# Altium project Mot-Gen-Set.PrjPcb
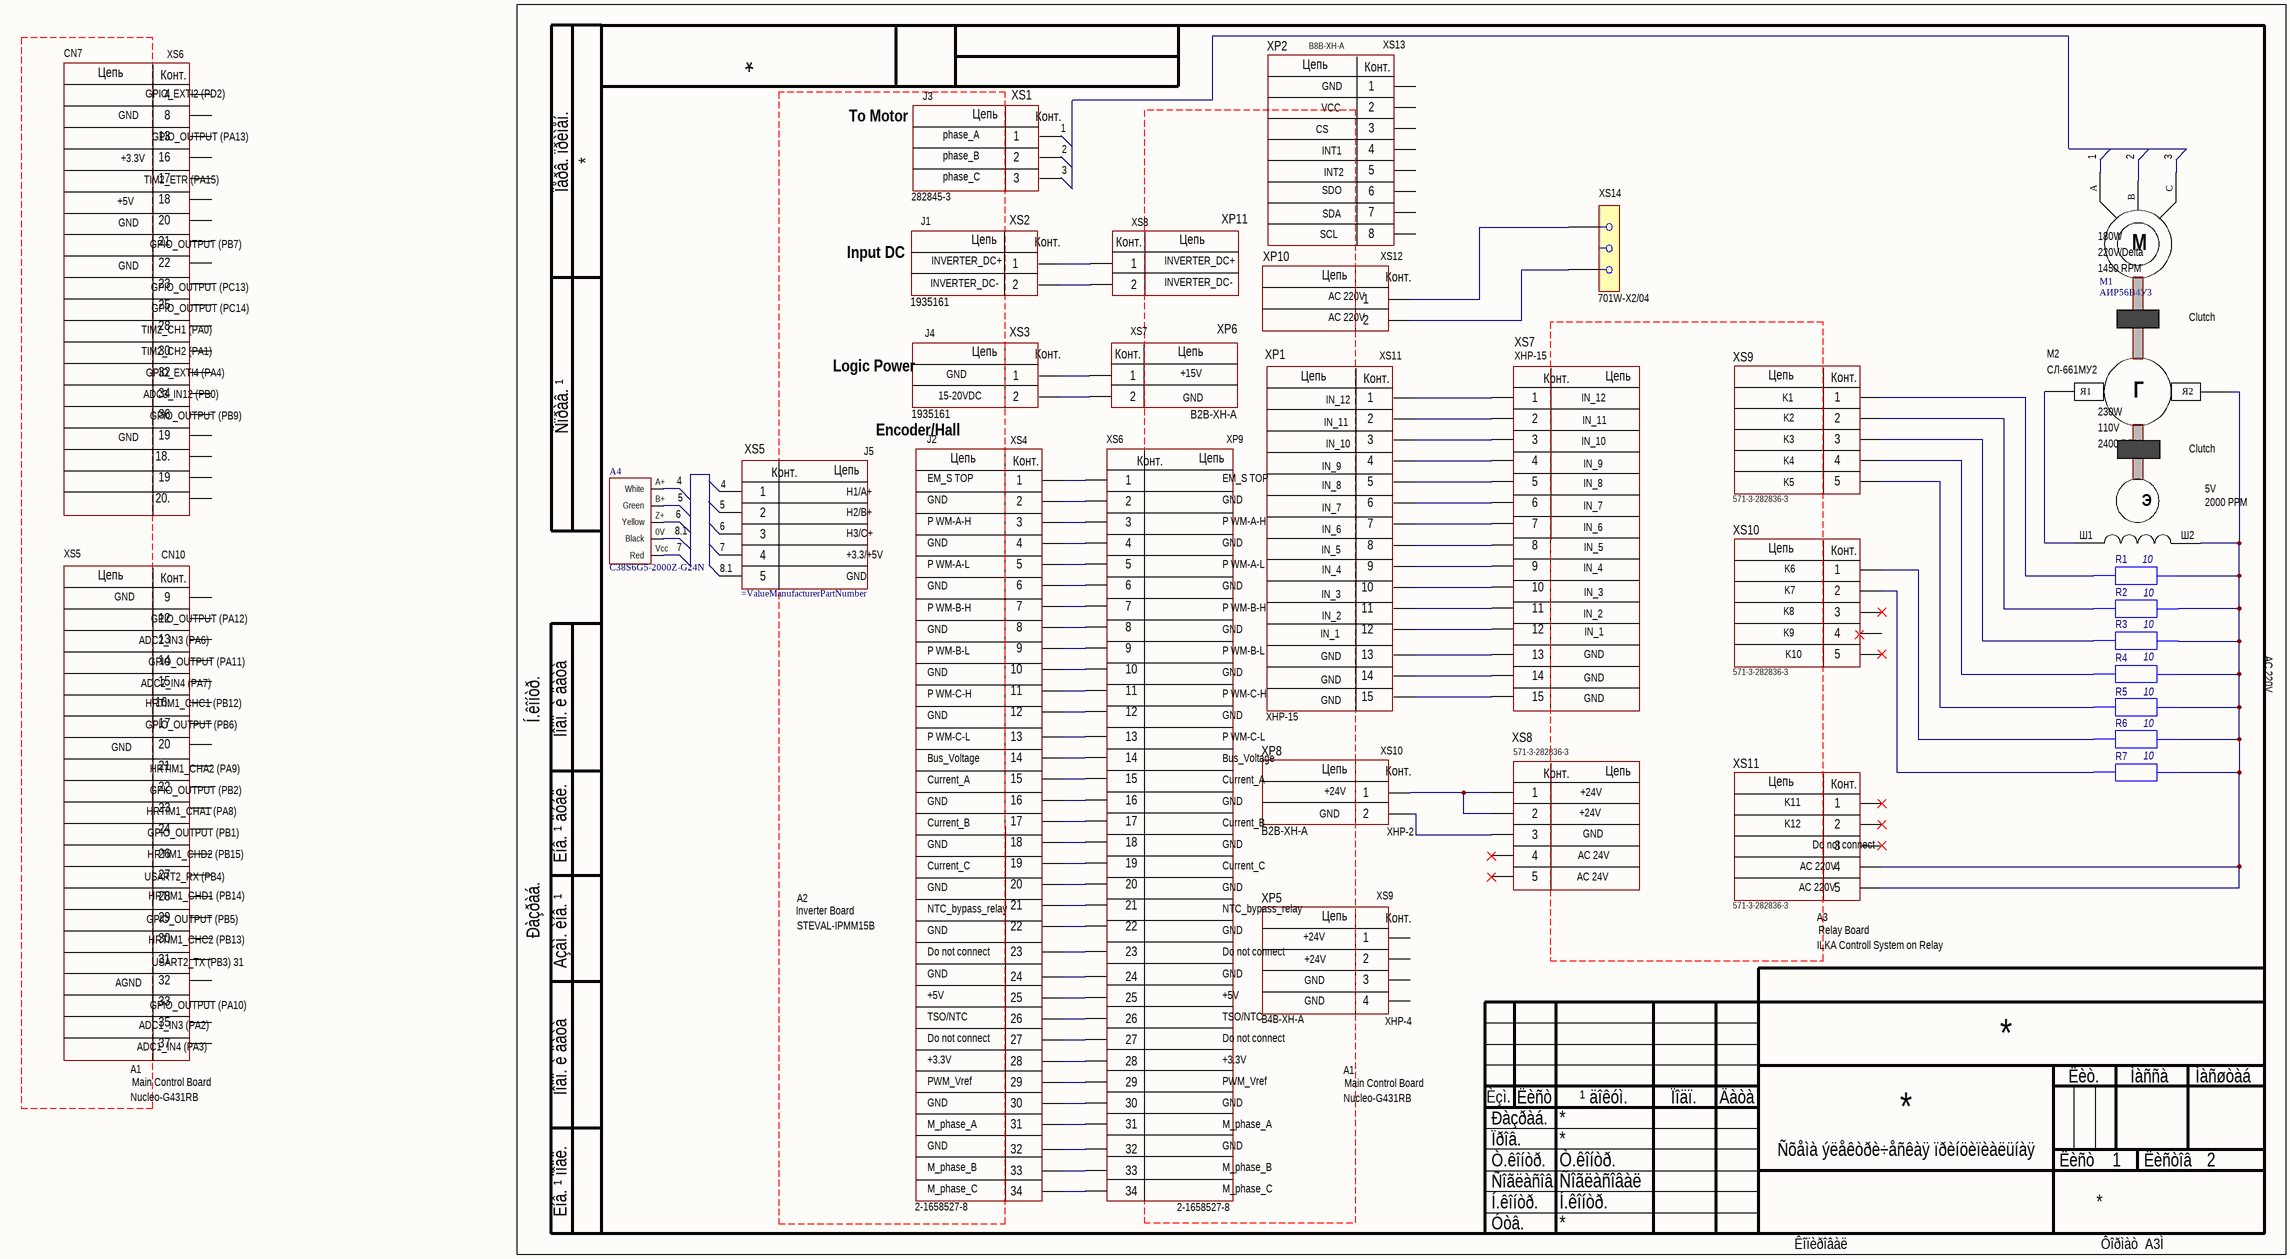
[diagram p0: wiring-harness-assembly.SchDoc]
2 sheets, 50 parts. Net scope: global (net labels, ports and power ports of the same name join across sheets).
Sheets:
  wiring-harness-assembly.SchDoc
  Nucleo-G431-Expansion-board.SchDoc

## Sheet wiring-harness-assembly.SchDoc
size 420 x 297 mm; SheetNumber: 1; SheetTotal: 2; PageSetup: Record=PageOptions¦CenterHorizontal=False¦CenterVertical=False¦PrintScale=0.95¦XCorrection=0.00¦YCorrection=0.00¦PrintKind=1¦BorderSize=5000000¦LeftOffset=0¦BottomOffset=0¦Orientation=1¦PaperLength=1000¦PaperWidth=1000¦Scale=100¦PaperSource=15¦PrintQuality=600¦MediaType=1¦DitherType=10¦PaperKind=A4¦PrintScaleMode=1; ProcessInspection: Ò.êîíòð.; NormInspection: Í.êîíòð.; Letter1Column: {}; Letter2Column: {}; Letter3Column: {}; DocumentType: Ñõåìà ýëåêòðè÷åñêàÿ ïðèíöèïèàëüíàÿ; AgreedBy: Ñîãëàñîâàë

### Parts
(Parts that share a designator on the sheet are numbered #1, #2 ... from top to bottom, then left to right.)
A4  C38S6G5-2000Z-G24N
M1  АИР56В4У3
M2  СЛ-661МУ2
R1  value 10  [R0805]  (hidden comment: Резистор 3 Ом ± 1% 100мВт 50В SMD 0603 -55...155°C CR-03FL7----3R "Viking")
R2  value 10  [R0805]  (hidden comment: Резистор 3 Ом ± 1% 100мВт 50В SMD 0603 -55...155°C CR-03FL7----3R "Viking")
R3  value 10  [R0805]  (hidden comment: Резистор 3 Ом ± 1% 100мВт 50В SMD 0603 -55...155°C CR-03FL7----3R "Viking")
R4  value 10  [R0805]  (hidden comment: Резистор 3 Ом ± 1% 100мВт 50В SMD 0603 -55...155°C CR-03FL7----3R "Viking")
R5  value 10  [R0805]  (hidden comment: Резистор 3 Ом ± 1% 100мВт 50В SMD 0603 -55...155°C CR-03FL7----3R "Viking")
R6  value 10  [R0805]  (hidden comment: Резистор 3 Ом ± 1% 100мВт 50В SMD 0603 -55...155°C CR-03FL7----3R "Viking")
R7  value 10  [R0805]  (hidden comment: Резистор 3 Ом ± 1% 100мВт 50В SMD 0603 -55...155°C CR-03FL7----3R "Viking")
XP1#1  XHP-15
XP2#1  B8B-XH-A
XP5#1  B4B-XH-A
XP6#1  B2B-XH-A
XP8#1  B2B-XH-A
XP10#1  B2B-XH-A  (value not drawn)
XP11#1  B2B-XH-A  (value not drawn)
XS1  282845-3
XS2  1935161
XS3  1935161
XS4  2-1658527-8
XS5#1  (no value)
XS5#2  CN10
XS6#1  CN7
XS6#2  2-1658527-8
XS7  XHP-15
XS8  571-3-282836-3
XS9  571-3-282836-3
XS10  571-3-282836-3
XS11  571-3-282836-3
XS14  701W-X2/04  [FP-701W-X2-04-MFG]

### Nets
1: M1.A XS1.1
2: M1.B(A) XS1.2
3: M1.C XS1.3
4: A4.A+(White)
5: A4.B+(Green)
6: A4.Z+(Yellow) XS5#1.3
7: A4.Vcc(Red) XS5#1.4
8.1: A4.0V(Black) XS5#1.5
NetM2_1: M2.1(Я1) M2.Ш1
NetM2_2: M2.2(Я2) M2.Ш2 R4.2 R5.2 R6.2 R7.2 XS11.4 XS11.5
NetR1_1: R1.1 XS9.1
NetR2_1: R2.1 XS9.2
NetR3_1: R3.1 XS9.3
NetR4_1: R4.1 XS9.4
NetR5_1: R5.1 XS9.5
NetR6_1: R6.1 XS10.1
NetR7_1: R7.1 XS10.2
NetXP1#1_1: XP1#1.1 XS7.1
NetXP1#1_2: XP1#1.2 XS7.2
NetXP1#1_3: XP1#1.3 XS7.3
NetXP1#1_4: XP1#1.4 XS7.4
NetXP1#1_5: XP1#1.5 XS7.5
NetXP1#1_6: XP1#1.6 XS7.6
NetXP1#1_7: XP1#1.7 XS7.7
NetXP1#1_8: XP1#1.8 XS7.8
NetXP1#1_9: XP1#1.9 XS7.9
NetXP1#1_10: XP1#1.10 XS7.10
NetXP1#1_11: XP1#1.11 XS7.11
NetXP1#1_12: XP1#1.12 XS7.12
NetXP1#1_13: XP1#1.13 XS7.13
NetXP1#1_14: XP1#1.14 XS7.14
NetXP1#1_15: XP1#1.15 XS7.15
NetXP6#1_1: XP6#1.1 XS3.1
NetXP6#1_2: XP6#1.2 XS3.2
NetXP8#1_1: XP8#1.1 XS8.1 XS8.2
NetXP8#1_2: XP8#1.2 XS8.3
NetXP10#1_1: XP10#1.1 XS14.1
NetXP10#1_2: XP10#1.2 XS14.2
NetXP11#1_1: XP11#1.1 XS2.1
NetXP11#1_2: XP11#1.2 XS2.2
NetXS4_1: XS4.1 XS6#2.1
NetXS4_2: XS4.2 XS6#2.2
NetXS4_3: XS4.3 XS6#2.3
NetXS4_4: XS4.4 XS6#2.4
NetXS4_5: XS4.5 XS6#2.5
NetXS4_6: XS4.6 XS6#2.6
NetXS4_7: XS4.7 XS6#2.7
NetXS4_8: XS4.8 XS6#2.8
NetXS4_9: XS4.9 XS6#2.9
NetXS4_10: XS4.10 XS6#2.10
NetXS4_11: XS4.11 XS6#2.11
NetXS4_12: XS4.12 XS6#2.12
NetXS4_13: XS4.13 XS6#2.13
NetXS4_14: XS4.14 XS6#2.14
NetXS4_15: XS4.15 XS6#2.15
NetXS4_16: XS4.16 XS6#2.16
NetXS4_17: XS4.17 XS6#2.17
NetXS4_18: XS4.18 XS6#2.18
NetXS4_19: XS4.19 XS6#2.19
NetXS4_20: XS4.20 XS6#2.20
NetXS4_21: XS4.21 XS6#2.21
NetXS4_22: XS4.22 XS6#2.22
NetXS4_23: XS4.23 XS6#2.23
NetXS4_24: XS4.24 XS6#2.24
NetXS4_25: XS4.25 XS6#2.25
NetXS4_26: XS4.26 XS6#2.26
NetXS4_27: XS4.27 XS6#2.27
NetXS4_28: XS4.28 XS6#2.28
NetXS4_29: XS4.29 XS6#2.29
NetXS4_30: XS4.30 XS6#2.30
NetXS4_31: XS4.31 XS6#2.31
NetXS4_32: XS4.32 XS6#2.32
NetXS4_33: XS4.33 XS6#2.33
NetXS4_34: XS4.34 XS6#2.34

Not connected (* = marked no-connect by the designer): R1 2; R2 2; R3 2; XP2#1 1 2 3 4 5 6 7 8; XP5#1 1 2 3 4; XS5#1 1 2; XS5#2 9 12 13 14 15 16(16.) 17 20 21 22(37) 23 24 26 27 28 29 30 31 32 33 35 37(22); XS6#1 4 8 13 16 17 18 18. 19 20 20. 21 22 23 25 28 30 32 34 36; XS8 4* 5*; XS10 3* 4 5*; XS11 1* 2* 3*

### Notes on the sheet
- GPIO_EXTI2 (PD2)
- J3
- GND
- (near XP2#1) XS13
- (near XS6#1) GPIO_OUTPUT (PA13)
- To Motor
- phase_A
- CS
- VCC
- +5V
- +3.3V
- TIM2_ETR (PA15)
- phase_B
- phase_C
- INT1
- SDO
- INT2
- (near XS6#1) GPIO_OUTPUT (PB7)
- Input DC
- J1
- (near XP11#1) XS8
- SCL
- SDA
- XS12
- (near M1) 180W
- (near M1) 220V/Delta
- (near XS6#1) GPIO_OUTPUT (PC13)
- (near XS6#1) GPIO_OUTPUT (PC14)
- AC 220V
- 1450 RPM
- TIM2_CH1 (PA0)
- TIM2_CH2 (PA1)
- J4
- XS7
- XS11
- Clutch
- ADC3_IN12 (PB0)
- GPIO_EXTI4 (PA4)
- (near XS6#1) GPIO_OUTPUT (PB9)
- Logic Power
- 15-20VDC
- +15V
- IN_12
- K1
- K2
- (near M2) 230W
- J5
- Encoder/Hall
- J2
- XP9
- IN_9
- IN_11
- IN_10
- K3
- K4
- (near M2) 110V
- (near M2) 2400 RPM
- (near M2) Clutch
- H1/A+
- H2/B+
- EM_S TOP
- P WM-A-H
- IN_8
- IN_7
- K5
- (near M2) Э
- (near M2) 2000 PPM
- (near M2) 5V
- H3/C+
- +3.3/+5V
- P WM-A-L
- IN_5
- IN_6
- IN_4
- K6
- (near XS5#2) GPIO_OUTPUT (PA12)
- P WM-B-H
- IN_3
- IN_2
- IN_1
- K8
- K7
- ADC2_IN3 (PA6)
- ADC2_IN4 (PA7)
- (near XS5#2) GPIO_OUTPUT (PA11)
- P WM-B-L
- K9
- K10
- HRTIM1_CHC1 (PB12)
- GPIO_OUTPUT (PB6)
- P WM-C-H
- P WM-C-L
- (near XS5#2) HRTIM1_CHA2 (PA9)
- (near XS5#2) GPIO_OUTPUT (PB2)
- Bus_Voltage
- Current_A
- +24V
- XS10
- HRTIM1_CHA1 (PA8)
- GPIO_OUTPUT (PB1)
- Current_B
- (near XP8#1) XHP-2
- K11
- K12
- Do not connect
- USART2_RX (PB4)
- HRTIM1_CHD2 (PB15)
- (near XS5#2) HRTIM1_CHD1 (PB14)
- A2
- Current_C
- (near XP5#1) XS9
- AC 24V
- GPIO_OUTPUT (PB5)
- (near XS5#2) HRTIM1_CHC2 (PB13)
- Inverter Board
- STEVAL-IPMM15B
- (near XS4) NTC_bypass_relay
- (near XS4) Do not connect
- (near XS6#2) NTC_bypass_relay
- (near XS6#2) Do not connect
- A3
- ILKA Controll System on Relay
- Relay Board
- AGND
- (near XS5#2) GPIO_OUTPUT (PA10)
- (near XS5#2) USART2_TX (PB3) 31
- ADC1_IN4 (PA3)
- ADC1_IN3 (PA2)
- TSO/NTC
- (near XP5#1) XHP-4
- A1
- Nucleo-G431RB
- Main Control Board
- PWM_Vref
- M_phase_A
- M_phase_C
- M_phase_B
- Labels drawn without touching a wire or pin: 4, 5, INVERTER_DC+, INVERTER_DC-
- Ïåðâ. ïðèìåí.
- Ñïðàâ. ¹
- Í.êîíòð.
- Ïîäï. è äàòà
- Èíâ. ¹ äóáë.
- Ðàçðàá.
- Âçàì. èíâ. ¹
- Èçì.
- Ëèñò
- ¹ äîêóì.
- Ïîäï.
- Äàòà
- Ëèò.
- Ìàññà
- Ìàñøòàá
- Ïðîâ.
- Ò.êîíòð.
- Ëèñòîâ
- Èíâ. ¹ ïîäë.
- Óòâ.
- Ñîãëàñîâ.
- Êîïèðîâàë
- Ôîðìàò  A3Ì
- (in symbol 2) Конт.; Цепь
- (in symbol 3) Цепь; Конт.
- (in symbol 4) Цепь; Конт.
- (in symbol 5) Цепь; Конт.
- (in symbol 8) Цепь; Конт.
- (in symbol 15) Цепь; Конт.
- (in symbol 20) Цепь; Конт.
- (in symbol 22) Цепь; Конт.
- (in symbol 34) Конт.; Цепь
- (in symbol Асинхронний двигатель) М
- (in symbol Дигатель постоянного тока) Г

### Library data of the parts
A4 = Encoder
M1 = Асинхронний двигатель
M2 = Дигатель постоянного тока
R1-R7 = CR-03FL7----3R
XP1#1 XS7 = 15
XP2#1 = 8
XP5#1 = 4
XP6#1 XP8#1 XP10#1 XP11#1 XS2 XS3 = 2
XS1 = 3
XS4 XS6#2 = 34
XS5#1 XS8-XS11 = 5
XS5#2 = 22
XS6#1 = 20
XS14 = CMP-64678-000002-1: PWR ENT RCPT IEC320-C14 PANEL QC; Primary Type: POWER; Voltage Rating (DC): 250V; Number of Contacts: 3; Panel Thickness: 1.5mm; Connector Type: Receptacle; Gender: Male; Current: 15A; Body Material: Thermoplastic; Number of Poles: 2; Fuse: No; Approvals: UL; Lead Free: Lead Free; Contact Type: Pin; Case/Package: 100; Mount: Panel; Number of Positions: 3; Current Rating: 15A; Series: 701W; RoHS Compliant: Yes; Housing Material: Nylon; Max Current Rating: 15A; Package Quantity: 100; Termination: Quick Connect; Packaging: Bulk; Voltage Rating: 250V; Orientation: Straight; Contact Plating: Nickel; Max Voltage Rating (AC): 250V

## Sheet Nucleo-G431-Expansion-board.SchDoc
size 420 x 297 mm; SheetNumber: 2; SheetTotal: 2; PageSetup: Record=PageOptions¦CenterHorizontal=False¦CenterVertical=False¦PrintScale=0.95¦XCorrection=0.00¦YCorrection=0.00¦PrintKind=1¦BorderSize=5000000¦LeftOffset=0¦BottomOffset=0¦Orientation=1¦PaperLength=1000¦PaperWidth=1000¦Scale=100¦PaperSource=15¦PrintQuality=600¦MediaType=1¦DitherType=10¦PaperKind=A4¦PrintScaleMode=1; ProcessInspection: Ò.êîíòð.; NormInspection: Í.êîíòð.; Letter1Column: {}; Letter2Column: {}; Letter3Column: {}; DocumentType: Ñõåìà ýëåêòðè÷åñêàÿ ïðèíöèïèàëüíàÿ; AgreedBy: Ñîãëàñîâàë
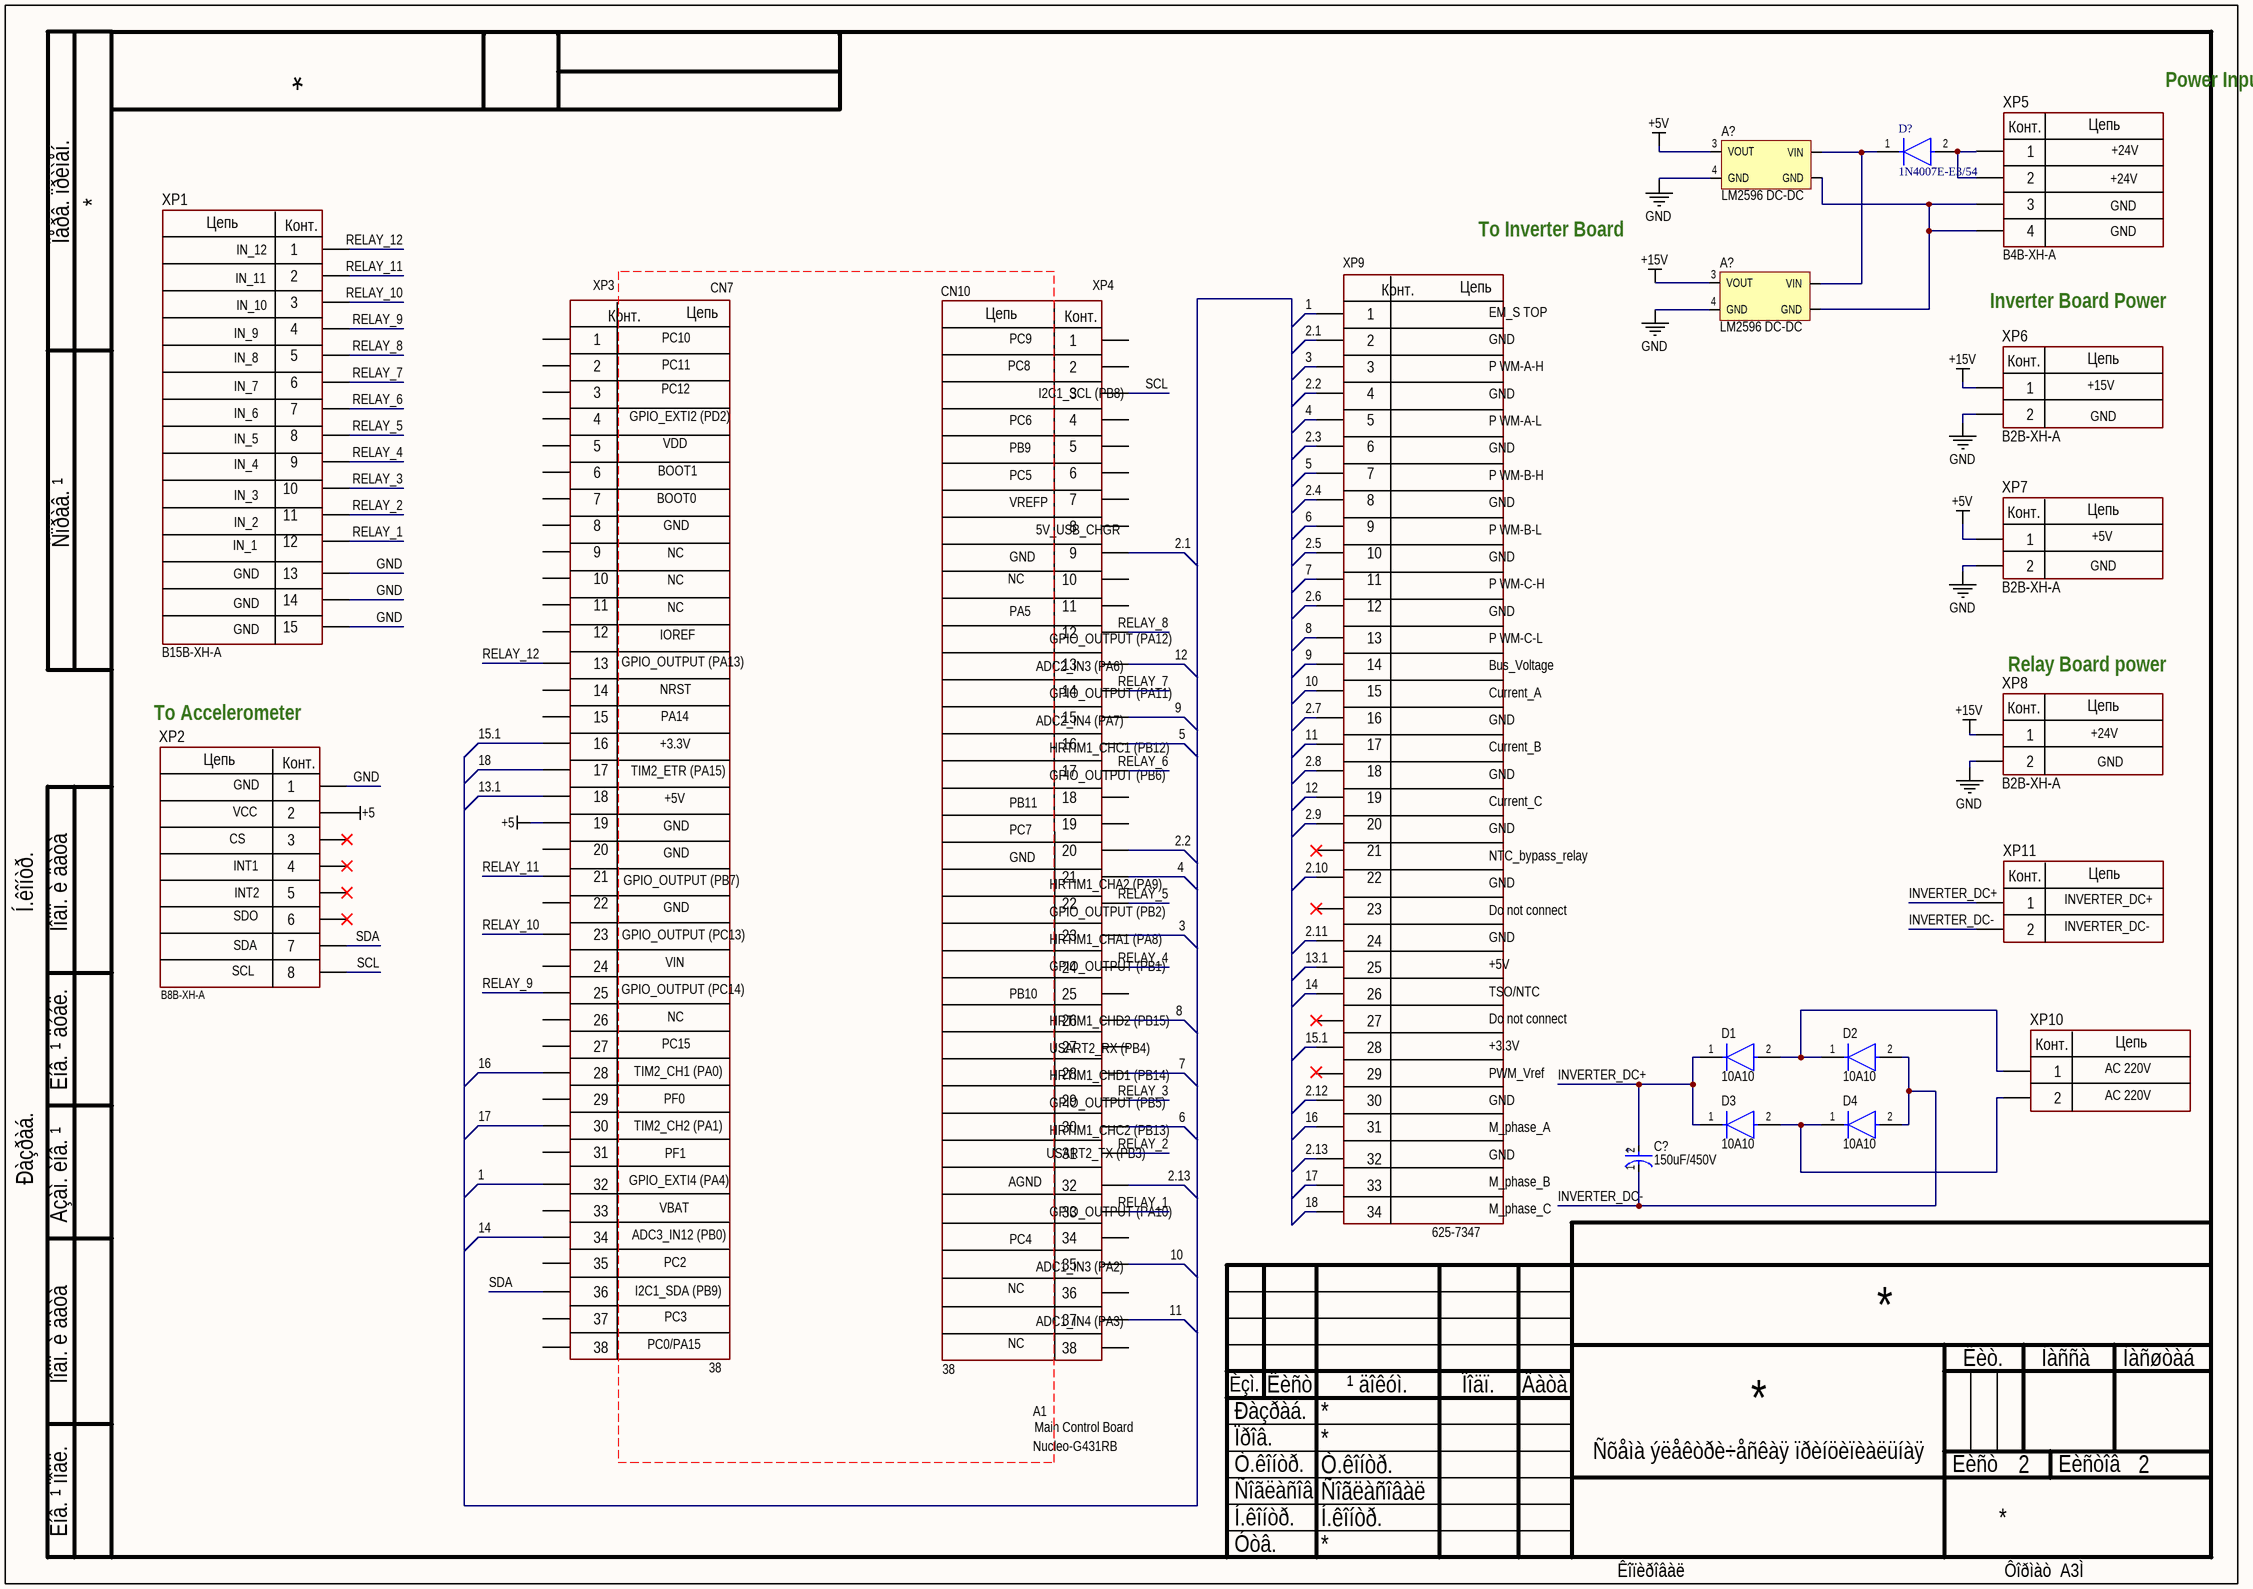
[diagram p1: Nucleo-G431-Expansion-board.SchDoc]

### Parts
(Parts that share a designator on the sheet are numbered #1, #2 ... from top to bottom, then left to right.)
A?#1  LM2596 DC-DC
A?#2  LM2596 DC-DC
C?  150uF/450V  [FP-RAD-TH-D_12_5_0_5-L_20-MFG]
CN7  38
CN10  38
D1  10A10  [FP-1N4007E-E3-54-MFG]
D2  10A10  [FP-1N4007E-E3-54-MFG]
D3  10A10  [FP-1N4007E-E3-54-MFG]
D4  10A10  [FP-1N4007E-E3-54-MFG]
D?  1N4007E-E3/54  [FP-1N4007E-E3-54-MFG]
XP1#2  B15B-XH-A
XP2#2  B8B-XH-A
XP5#2  B4B-XH-A
XP6#2  B2B-XH-A
XP7  B2B-XH-A
XP8#2  B2B-XH-A
XP9  625-7347
XP10#2  B2B-XH-A  (value not drawn)
XP11#2  B2B-XH-A  (value not drawn)

### Nets
+5: CN7.19 XP2#2.2
+5V: A?#1.3(VOUT) XP7.1
+15V: A?#2.3(VOUT) XP6#2.1 XP8#2.1
GND: A?#1.4(GND) A?#2.4(GND) XP1#2.13 XP1#2.14 XP1#2.15 XP2#2.1 XP6#2.2 XP7.2 XP8#2.2
1: CN7.32 XP9.1
2.1: CN10.9 XP9.2
2.2: CN10.20 XP9.4
2.3: XP9.6
2.4: XP9.8
2.5: XP9.10
2.6: XP9.12
2.7: XP9.16
2.8: XP9.18
2.9: XP9.20
2.10: XP9.22
2.11: XP9.24
2.12: XP9.30
2.13: CN10.32 XP9.32
3: CN10.23 XP9.3
4: CN10.21 XP9.5
5: CN10.16 XP9.7
6: CN10.30 XP9.9
7: CN10.28 XP9.11
8: CN10.26 XP9.13
9: CN10.15 XP9.14
10: CN10.35 XP9.15
11: CN10.37 XP9.17
12: CN10.13 XP9.19
13.1: CN7.18 XP9.25
14: CN7.34 XP9.26
15.1: CN7.16 XP9.28
16: CN7.28 XP9.31
17: CN7.30 XP9.33
18: CN7.17 XP9.34
INVERTER_DC+: C?.2(A) D1.1(C) D3.1(C) XP11#2.1
INVERTER_DC-: C?.1(C) D2.2(A) D4.2(A) XP11#2.2
RELAY_1: CN10.33 XP1#2.12
RELAY_2: CN10.31 XP1#2.11
RELAY_3: CN10.29 XP1#2.10
RELAY_4: CN10.24 XP1#2.9
RELAY_5: CN10.22 XP1#2.8
RELAY_6: CN10.17 XP1#2.7
RELAY_7: CN10.14 XP1#2.6
RELAY_8: CN10.12 XP1#2.5
RELAY_9: CN7.25 XP1#2.4
RELAY_10: CN7.23 XP1#2.3
RELAY_11: CN7.21 XP1#2.2
RELAY_12: CN7.13 XP1#2.1
SCL: CN10.3 XP2#2.8
SDA: CN7.36 XP2#2.7
NetA?#1_1: A?#1.1(VIN) A?#2.1(VIN) D?.1(C)
NetA?#1_2: A?#1.2(GND) A?#2.2(GND) XP5#2.3 XP5#2.4
NetD1_2: D1.2(A) D2.1(C) XP10#2.1
NetD3_2: D3.2(A) D4.1(C) XP10#2.2
NetD?_2: D?.2(A) XP5#2.1 XP5#2.2

Not connected (* = marked no-connect by the designer): CN7 1 2 3 4 5 6 7 8 9 10 11 12 14 15 20 22 24 26 27 29 31 33 35 37 38; CN10 1 2 4 5 6 7 8 10 11 18 19 25 27 34 36 38; XP2#2 3* 4* 5* 6*; XP9 21* 23* 27* 29

### Notes on the sheet
- Power Input
- +24V
- IN_12
- To Inverter Board
- GND
- IN_11
- IN_10
- (near CN7) XP3
- (near CN10) XP4
- EM_S TOP
- Inverter Board Power
- IN_8
- IN_9
- IN_7
- PC12
- PC10
- PC11
- PC8
- PC9
- I2C1_SCL (PB8)
- P WM-A-H
- +15V
- IN_5
- IN_6
- GPIO_EXTI2 (PD2)
- VDD
- PC6
- PB9
- P WM-A-L
- IN_3
- IN_4
- IN_2
- BOOT0
- BOOT1
- PC5
- VREFP
- P WM-B-H
- IN_1
- NC
- 5V_USB_CHGR
- P WM-B-L
- P WM-C-H
- +5V
- (near CN7) GPIO_OUTPUT (PA13)
- IOREF
- PA5
- (near CN10) GPIO_OUTPUT (PA12)
- P WM-C-L
- To Accelerometer
- NRST
- PA14
- ADC2_IN3 (PA6)
- ADC2_IN4 (PA7)
- (near CN10) GPIO_OUTPUT (PA11)
- Bus_Voltage
- Current_A
- Relay Board power
- TIM2_ETR (PA15)
- +3.3V
- (near CN10) HRTIM1_CHC1 (PB12)
- (near CN10) GPIO_OUTPUT (PB6)
- Current_B
- CS
- VCC
- PB11
- PC7
- (near XP9) NTC_bypass_relay
- Current_C
- INT1
- SDO
- INT2
- (near CN7) GPIO_OUTPUT (PB7)
- (near CN10) HRTIM1_CHA2 (PA9)
- (near CN10) GPIO_OUTPUT (PB2)
- (near XP9) Do not connect
- SCL
- SDA
- (near CN7) GPIO_OUTPUT (PC14)
- (near CN7) GPIO_OUTPUT (PC13)
- VIN
- PB10
- (near CN10) HRTIM1_CHA1 (PA8)
- (near CN10) GPIO_OUTPUT (PB1)
- TSO/NTC
- PC15
- (near CN10) HRTIM1_CHD2 (PB15)
- (near CN10) USART2_RX (PB4)
- AC 220V
- TIM2_CH2 (PA1)
- TIM2_CH1 (PA0)
- PF0
- (near CN10) HRTIM1_CHC2 (PB13)
- (near CN10) HRTIM1_CHD1 (PB14)
- (near CN10) GPIO_OUTPUT (PB5)
- M_phase_A
- PWM_Vref
- GPIO_EXTI4 (PA4)
- PF1
- AGND
- USART2_TX (PB3)
- M_phase_B
- ADC3_IN12 (PB0)
- VBAT
- PC2
- PC4
- ADC1_IN3 (PA2)
- (near CN10) GPIO_OUTPUT (PA10)
- M_phase_C
- I2C1_SDA (PB9)
- PC3
- ADC1_IN4 (PA3)
- PC0/PA15
- A1
- Nucleo-G431RB
- Main Control Board
- Labels drawn without touching a wire or pin: INVERTER_DC+, INVERTER_DC-
- Ïåðâ. ïðèìåí.
- Ñïðàâ. ¹
- Í.êîíòð.
- Ïîäï. è äàòà
- Èíâ. ¹ äóáë.
- Ðàçðàá.
- Âçàì. èíâ. ¹
- Èçì.
- Ëèñò
- ¹ äîêóì.
- Ïîäï.
- Äàòà
- Ëèò.
- Ìàññà
- Ìàñøòàá
- Ïðîâ.
- Ò.êîíòð.
- Ëèñòîâ
- Èíâ. ¹ ïîäë.
- Óòâ.
- Ñîãëàñîâ.
- Êîïèðîâàë
- Ôîðìàò  A3Ì
- (in symbol 2) Конт.; Цепь
- (in symbol 4) Цепь; Конт.
- (in symbol 8) Цепь; Конт.
- (in symbol 15) Цепь; Конт.
- (in symbol 34) Цепь; Конт.
- (in symbol 38) Цепь; Конт.
- (in symbol CMP-05427-000677-1) +

### Library data of the parts
A?#1 A?#2 = LM2596-DC-DC
C? = CMP-05427-000677-1: Aluminum Electrolytic Capacitors (Radial Lead Type) 10uF ±20% 450V; Ripple Current: 130mA; Lead Diameter: 0.6mm; Life (Hours): 2000Hour; Lead/Base Style: Straight; Package Quantity: 500; Radiation Hardening: No; Series: M; Voltage Rating (DC): 450V; Voltage Rating: 450V; Lead Pitch: 5mm; Height - Seated (Max): 0.866inch; Max Operating Temperature: 85°C; Termination: Radial; Case/Package: Radial; Capacitance: 10uF; Min Operating Temperature: -25°C; Tolerance: 20%; Length: 20mm; Mount: Through Hole; Height: 20mm; Packaging: Ammo Pack; Diameter: 12.5mm; RoHS Compliant: Yes
D1-D4 D? = CMP-02540-000087-1: DIODE GEN PURP 1KV 1A DO204AL; Peak Non-Repetitive Surge Current: 45A; Forward Voltage: 1.1V; Element Configuration: Single; Max Reverse Current: 5uA; Max Repetitive Reverse Voltage (Vrrm): 1kV; RoHS Compliant: Yes; Max Surge Current: 45A; Min Operating Temperature: -50°C; Radiation Hardening: No; Average Rectified Current: 1A; Series: -; Packaging: Tape and Reel; Contact Plating: Tin; Package Quantity: 5500; Max Reverse Voltage (DC): 1kV; Reverse Voltage: 1kV; Number of Pins: 2; Max Operating Temperature: 150°C; Case/Package: DO-41; Mount: Through Hole
XP1#2 = 15
XP2#2 = 8
XP5#2 = 4
XP6#2 XP7 XP8#2 XP10#2 XP11#2 = 2
XP9 = 34

## Nets that join several sheets
1: wiring-harness-assembly (M1.A XS1.1), Nucleo-G431-Expansion-board (CN7.32 XP9.1)
3: wiring-harness-assembly (M1.C XS1.3), Nucleo-G431-Expansion-board (CN10.23 XP9.3)
4: wiring-harness-assembly (A4.A+), Nucleo-G431-Expansion-board (CN10.21 XP9.5)
5: wiring-harness-assembly (A4.B+), Nucleo-G431-Expansion-board (CN10.16 XP9.7)
6: wiring-harness-assembly (A4.Z+ XS5#1.3), Nucleo-G431-Expansion-board (CN10.30 XP9.9)
7: wiring-harness-assembly (A4.Vcc XS5#1.4), Nucleo-G431-Expansion-board (CN10.28 XP9.11)